# EAGLE design AutoTuner (EAGLE 9.6.2)

## Sheet 1 of 4: mcu
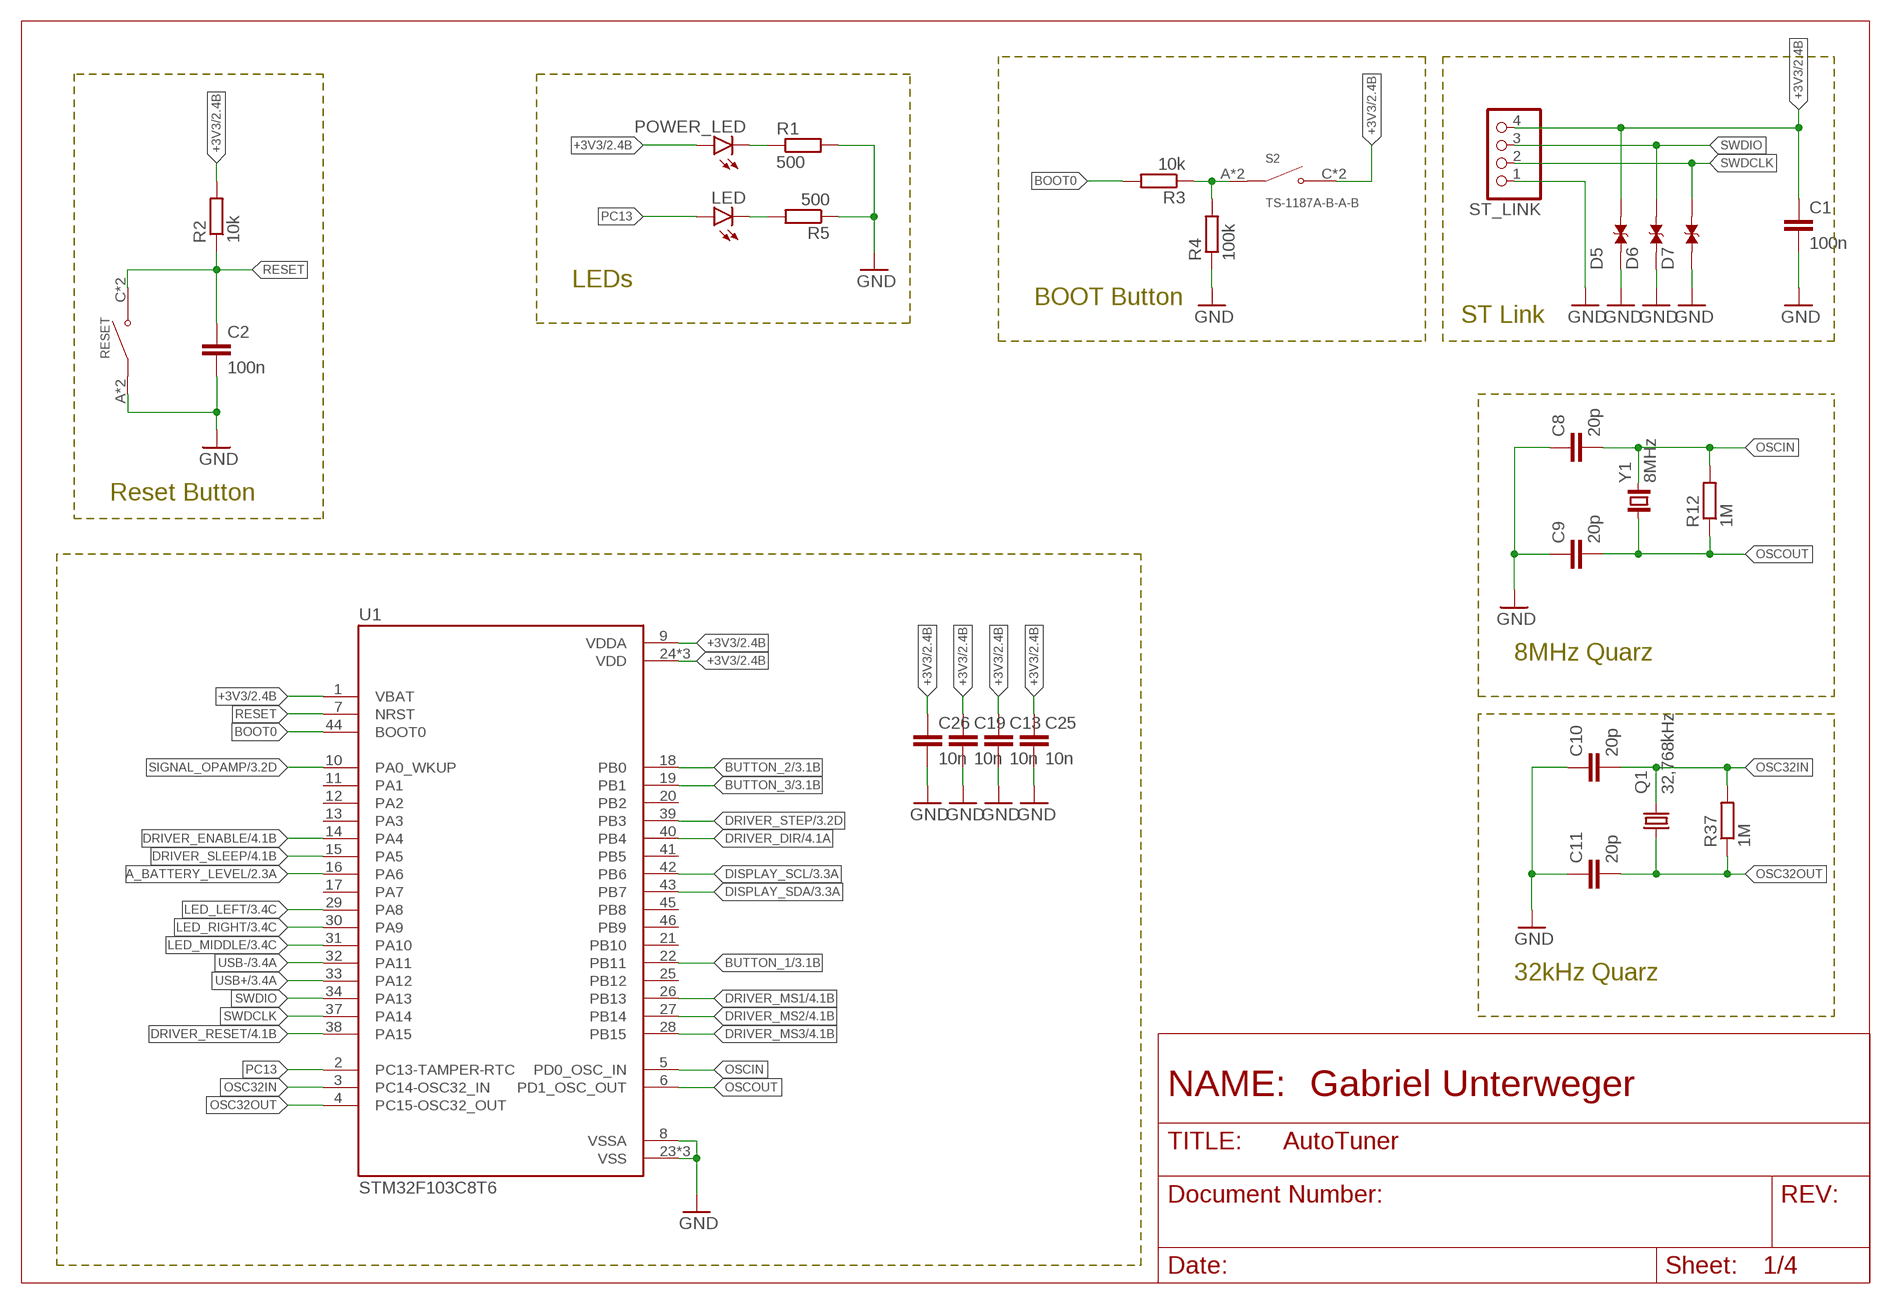
[diagram p0: schematic, sheet 1]

### Parts
C1  100n  C-EUC0805  [C0805]
C2  100n  C-EUC0805  [C0805]
C8  20p  C-EUC0805  [C0805]
C9  20p  C-EUC0805  [C0805]
C10  20p  C-EUC0805  [C0805]
C11  20p  C-EUC0805  [C0805]
C13  10n  C-EUC0805  [C0805]
C19  10n  C-EUC0805  [C0805]
C25  10n  C-EUC0805  [C0805]
C26  10n  C-EUC0805  [C0805]
D5  TESD5V0L1UC_RJG  [DIO_TESD5V0L1UC_RJG]
D6  TESD5V0L1UC_RJG  [DIO_TESD5V0L1UC_RJG]
D7  TESD5V0L1UC_RJG  [DIO_TESD5V0L1UC_RJG]
LED  LEDCHIPLED_0805  [CHIPLED_0805]
POWER_LED  LEDCHIPLED_0805  [CHIPLED_0805]
Q1  32,768kHz  KX-327-NHF  [3.2X1.5]
R1  500  R-EU_R0805  [R0805]
R2  10k  R-EU_R0805  [R0805]
R3  10k  R-EU_R0805  [R0805]
R4  100k  R-EU_R0805  [R0805]
R5  500  R-EU_R0805  [R0805]
R12  1M  R-EU_R0805  [R0805]
R37  1M  R-EU_R0805  [R0805]
RESET  TS-1187A-B-A-B  [SW_TS-1187A-B-A-B]
S2  TS-1187A-B-A-B  [SW_TS-1187A-B-A-B]
ST_LINK  PINHD-1X4  [1X04]
U1  STM32F103C8T6  [QFP50P900X900X160-48N]
Y1  8MHz  CRYSTAL_NX5032GA  [CRYSTAL_2-SMD-5X3]

### Nets
+3V3: C1.1 C13.1 C19.1 C25.1 C26.1 D5.2 POWER_LED.A R2.2 S2.C(NO) S2.D(NO) ST_LINK.4 U1.1(VBAT) U1.9(VDDA) U1.24(VDD) U1.36(VDD) U1.48(VDD) ; also sheet 2,3,4
A_BATTERY_LEVEL: U1.16(PA6) ; also sheet 2
BOOT0: R3.2 U1.44(BOOT0)
BUTTON_1: U1.22(PB11) ; also sheet 3
BUTTON_2: U1.18(PB0) ; also sheet 3
BUTTON_3: U1.19(PB1) ; also sheet 3
DISPLAY_SCL: U1.42(PB6) ; also sheet 3
DISPLAY_SDA: U1.43(PB7) ; also sheet 3
DRIVER_DIR: U1.40(PB4) ; also sheet 4
DRIVER_ENABLE: U1.14(PA4) ; also sheet 4
DRIVER_MS1: U1.26(PB13) ; also sheet 4
DRIVER_MS2: U1.27(PB14) ; also sheet 4
DRIVER_MS3: U1.28(PB15) ; also sheet 4
DRIVER_RESET: U1.38(PA15) ; also sheet 4
DRIVER_SLEEP: U1.15(PA5) ; also sheet 4
DRIVER_STEP: U1.39(PB3) ; also sheet 3,4
GND: C1.2 C2.2 C8.1 C9.1 C10.1 C11.1 C13.2 C19.2 C25.2 C26.2 D5.1 D6.1 D7.1 R1.2 R4.1 R5.1 RESET.A(COM) RESET.B(COM) ST_LINK.1 U1.8(VSSA) U1.23(VSS) U1.35(VSS) U1.47(VSS) ; also sheet 2,3,4
LED_LEFT: U1.29(PA8) ; also sheet 3
LED_MIDDLE: U1.31(PA10) ; also sheet 3
LED_RIGHT: U1.30(PA9) ; also sheet 3
N$2: LED.C R5.2
N$3: POWER_LED.C R1.1
N$5: R3.1 R4.2 S2.A(COM) S2.B(COM)
OSC32IN: C10.2 Q1.2 R37.2 U1.3(PC14-OSC32_IN)
OSC32OUT: C11.2 Q1.1 R37.1 U1.4(PC15-OSC32_OUT)
OSCIN: C8.2 R12.2 U1.5(PD0_OSC_IN) Y1.2
OSCOUT: C9.2 R12.1 U1.6(PD1_OSC_OUT) Y1.1
PC13: LED.A U1.2(PC13-TAMPER-RTC)
RESET: C2.1 R2.1 RESET.C(NO) RESET.D(NO) U1.7(NRST)
SIGNAL_OPAMP: U1.10(PA0_WKUP) ; also sheet 3,4
SWDCLK: D7.2 ST_LINK.2 U1.37(PA14)
SWDIO: D6.2 ST_LINK.3 U1.34(PA13)
USB+: U1.33(PA12) ; also sheet 3
USB-: U1.32(PA11) ; also sheet 3
Unconnected: U1.11(PA1) U1.12(PA2) U1.13(PA3) U1.17(PA7) U1.20(PB2) U1.21(PB10) U1.25(PB12) U1.41(PB5) U1.45(PB8) U1.46(PB9)

### Notes on the sheet
- LEDs
- BOOT Button
- ST Link
- Reset Button
- 8MHz Quarz
- 32kHz Quarz

## Sheet 2 of 4: battery / voltage converter
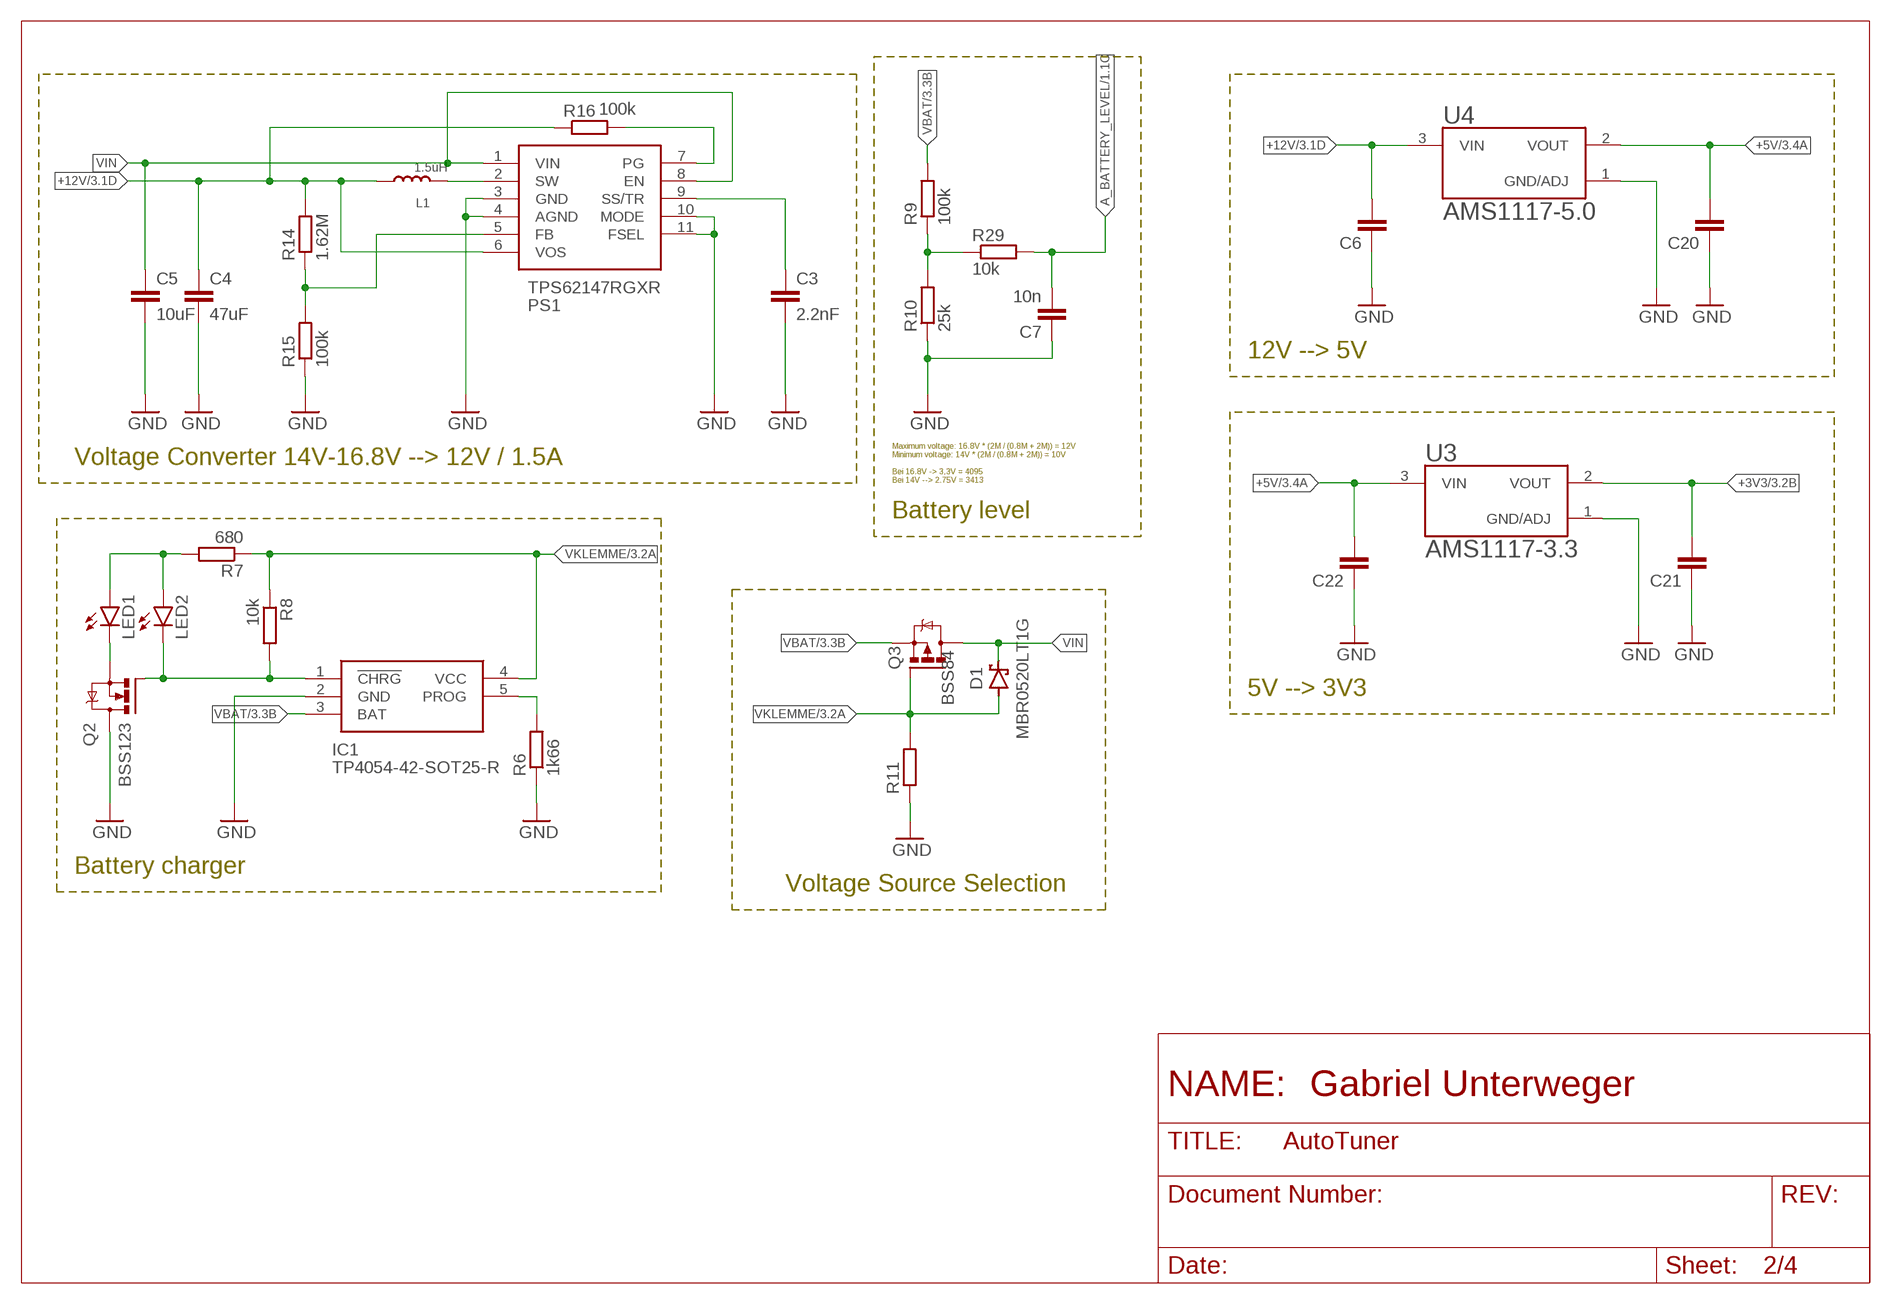
[diagram p1: schematic, sheet 2]

### Parts
C3  2.2nF  C-EUC0805  [C0805]
C4  47uF  C-EUC0805  [C0805]
C5  10uF  C-EUC0805  [C0805]
C6  C-EUC0805  [C0805]
C7  10n  C-EUC0805  [C0805]
C20  C-EUC0805  [C0805]
C21  C-EUC0805  [C0805]
C22  C-EUC0805  [C0805]
D1  MBR0520LT1G  SCHOTTKY_MBR0520LT1GDO-219  [SODFL3718X115]
IC1  TP4054-42-SOT25-R  [SOT95P280X100-5N]
L1  1.5uH  PSPCAQ54  [PSPCAQ54]
LED1  LEDCHIPLED_0805  [CHIPLED_0805]
LED2  LEDCHIPLED_0805  [CHIPLED_0805]
PS1  TPS62147RGXR  [TPS621361RGXT]
Q2  BSS123  NMOSFET_BSS123_SOT23-GSD  [SOT23]
Q3  BSS84  PMOSFET_BSS84_SOT23-GSD  [SOT23]
R6  1k66  R-EU_R0805  [R0805]
R7  680  R-EU_R0805  [R0805]
R8  10k  R-EU_R0805  [R0805]
R9  100k  R-EU_R0805  [R0805]
R10  25k  R-EU_R0805  [R0805]
R11  R-EU_R0805  [R0805]
R14  1.62M  R-EU_R0805  [R0805]
R15  100k  R-EU_R0805  [R0805]
R16  100k  R-EU_R0805  [R0805]
R29  10k  R-EU_R0805  [R0805]
U3  AMS1117-3.3  [SOT229P700X180-4N]
U4  AMS1117-5.0  [SOT229P700X180-4N]

### Nets
+3V3: C21.2 U3.2(VOUT) ; also sheet 1,3,4
+5V: C20.2 C22.2 U3.3(VIN) U4.2(VOUT) ; also sheet 3,4
+12V: C4.1 C6.2 L1.1 PS1.6(VOS) R14.2 R16.1 U4.3(VIN) ; also sheet 3,4
A_BATTERY_LEVEL: C7.2 R29.2 ; also sheet 1
GND: C3.2 C4.2 C5.2 C6.1 C7.1 C20.1 C21.1 C22.1 IC1.2(GND) PS1.3(GND) PS1.4(AGND) PS1.10(MODE) PS1.11(FSEL) Q2.3(D) R6.1 R10.1 R11.1 R15.1 U3.1(GND/ADJ) U4.1(GND/ADJ) ; also sheet 1,3,4
N$1: C3.1 PS1.9(SS/TR)
N$4: R9.1 R10.2 R29.1
N$6: L1.2 PS1.2(SW)
N$7: PS1.5(FB) R14.1 R15.2
N$8: IC1.5(PROG) R6.2
N$9: IC1.1(!CHRG) LED2.C Q2.1(G) R8.2
N$10: PS1.7(PG) R16.2
N$11: LED1.A LED2.A R7.2
N$12: LED1.C Q2.2(S)
VBAT: IC1.3(BAT) Q3.2(S) R9.2 ; also sheet 3
VIN: C5.1 D1.1(C) PS1.1(VIN) PS1.8(EN) Q3.3(D)
VKLEMME: D1.2(A) IC1.4(VCC) Q3.1(G) R7.1 R8.1 R11.2 ; also sheet 3

### Notes on the sheet
- 12V --> 5V
- Voltage Converter 14V-16.8V --> 12V / 1.5A
- Maximum voltage: 16.8V * (2M / (0.8M + 2M)) = 12V
  Minimum voltage: 14V * (2M / (0.8M + 2M)) = 10V
  
  Bei 16.8V -> 3,3V = 4095
  Bei 14V --> 2.75V = 3413
- Battery level
- 5V --> 3V3
- Battery charger
- Voltage Source Selection

## Sheet 3 of 4: I/O
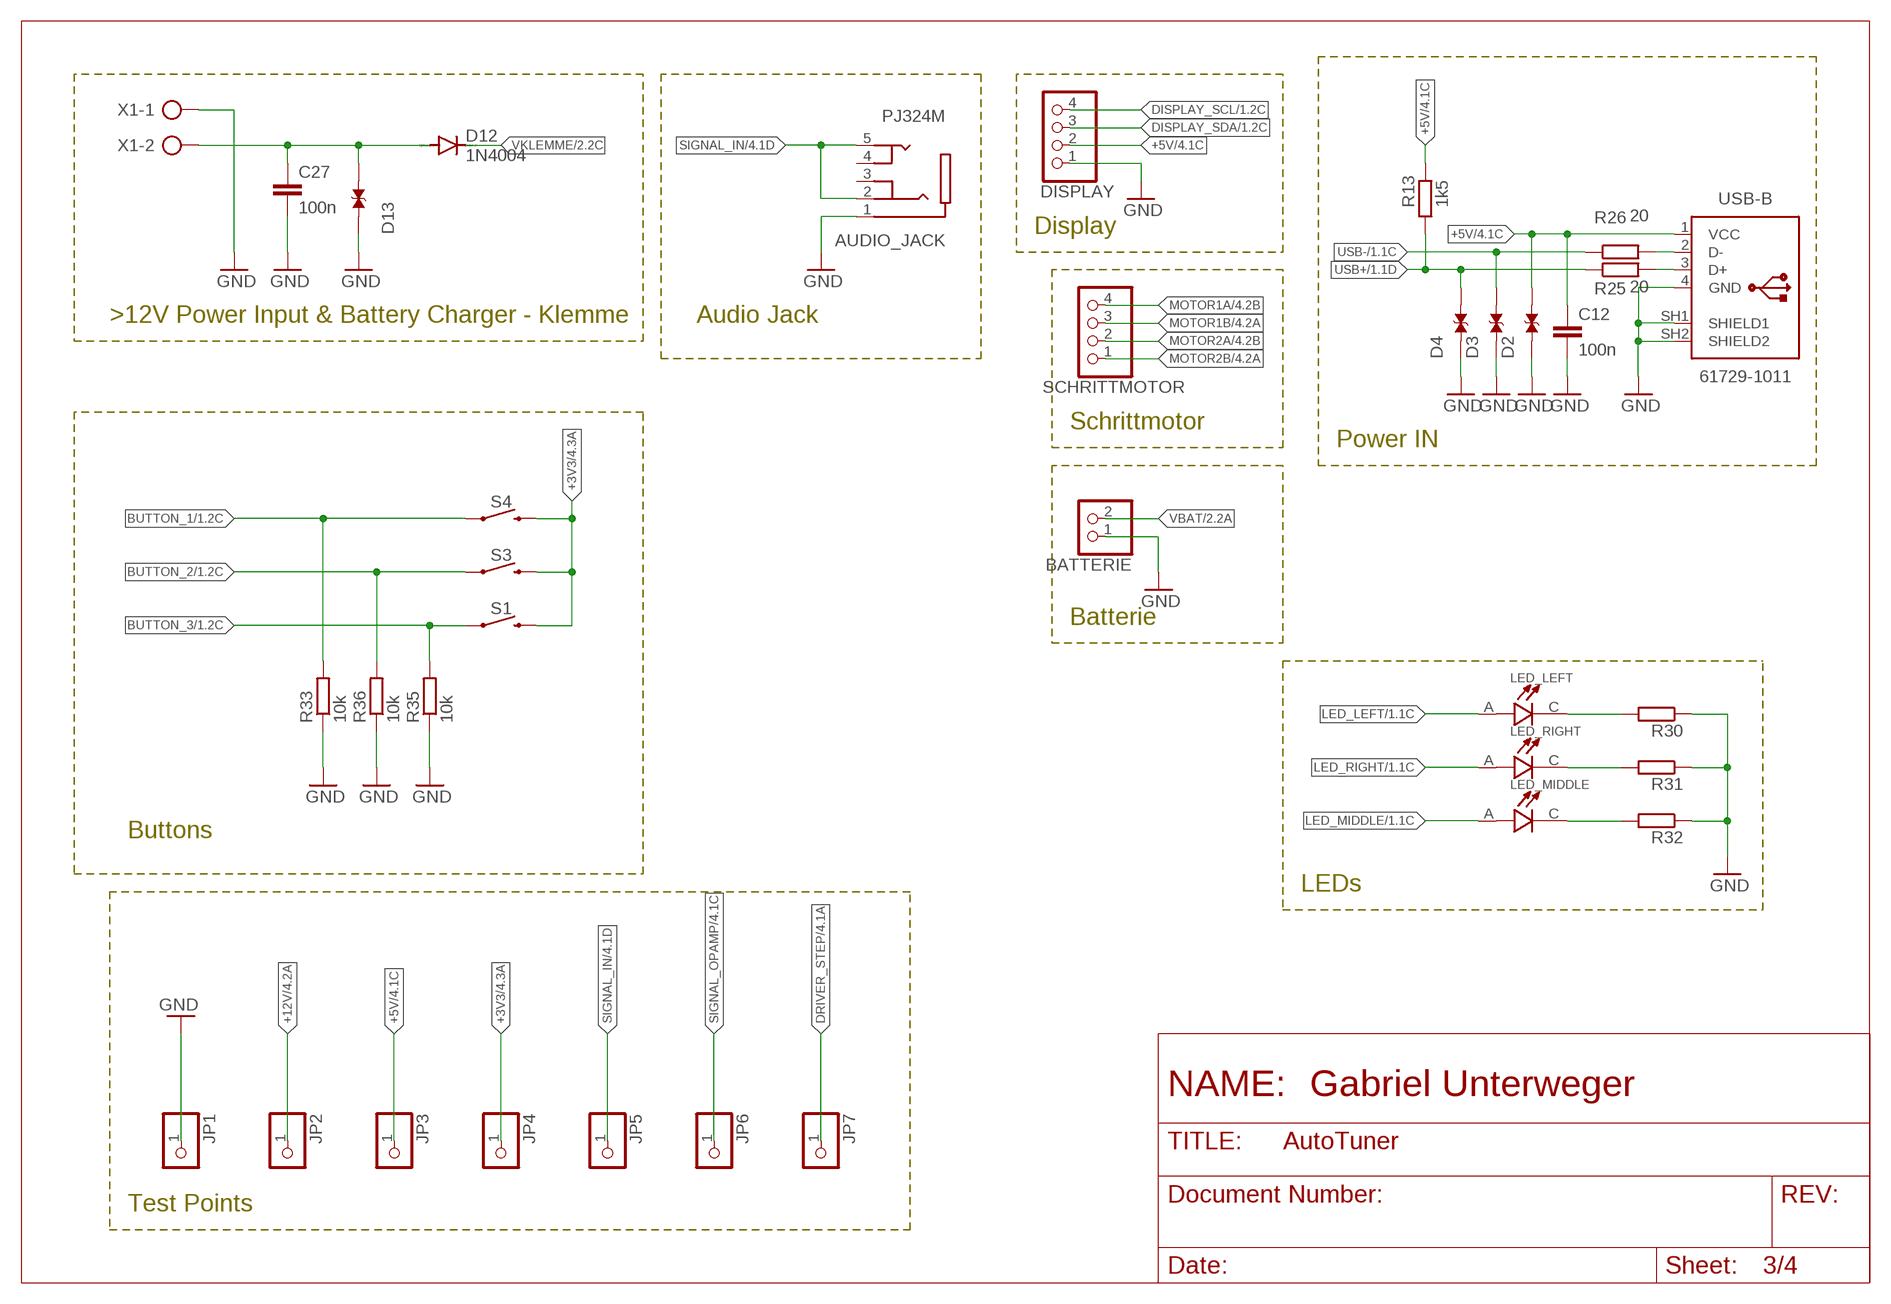
[diagram p2: schematic, sheet 3]

### Parts
AUDIO_JACK  PJ324M  [WENZHOU_PJ324M]
BATTERIE  PINHD-1X2  [1X02]
C12  100n  C-EUC0805  [C0805]
C27  100n  C-EUC0805  [C0805]
D2  TESD5V0L1UC_RJG  [DIO_TESD5V0L1UC_RJG]
D3  TESD5V0L1UC_RJG  [DIO_TESD5V0L1UC_RJG]
D4  TESD5V0L1UC_RJG  [DIO_TESD5V0L1UC_RJG]
D12  1N4004  [DO41-10]
D13  TESD5V0L1UC_RJG  [DIO_TESD5V0L1UC_RJG]
DISPLAY  PINHD-1X4  [1X04]
JP1  PINHD-1X1  [1X01]
JP2  PINHD-1X1  [1X01]
JP3  PINHD-1X1  [1X01]
JP4  PINHD-1X1  [1X01]
JP5  PINHD-1X1  [1X01]
JP6  PINHD-1X1  [1X01]
JP7  PINHD-1X1  [1X01]
LED_LEFT  L-53GD  [LEDRD254W50D500H1060]
LED_MIDDLE  L-53GD  [LEDRD254W50D500H1060]
LED_RIGHT  L-53GD  [LEDRD254W50D500H1060]
R13  1k5  R-EU_R0805  [R0805]
R25  20  R-EU_R0805  [R0805]
R26  20  R-EU_R0805  [R0805]
R30  R-EU_R0805  [R0805]
R31  R-EU_R0805  [R0805]
R32  R-EU_R0805  [R0805]
R33  10k  R-EU_R0805  [R0805]
R35  10k  R-EU_R0805  [R0805]
R36  10k  R-EU_R0805  [R0805]
S1  MOMENTARY-SWITCH-SPST-PTH-12MM  [TACTILE_SWITCH_PTH_12MM]
S3  MOMENTARY-SWITCH-SPST-PTH-12MM  [TACTILE_SWITCH_PTH_12MM]
S4  MOMENTARY-SWITCH-SPST-PTH-12MM  [TACTILE_SWITCH_PTH_12MM]
SCHRITTMOTOR  PINHD-1X4  [1X04]
USB-B  61729-1011  [61729-1011BLF]
X1  AK300/2  [AK300/2]

### Nets
+3V3: JP4.1 S1.3 S3.3 S4.3 ; also sheet 1,2,4
+5V: C12.1 D2.2 DISPLAY.2 JP3.1 R13.2 USB-B.1(VCC) ; also sheet 2,4
+12V: JP2.1 ; also sheet 2,4
BUTTON_1: R33.2 S4.1 ; also sheet 1
BUTTON_2: R36.2 S3.1 ; also sheet 1
BUTTON_3: R35.2 S1.1 ; also sheet 1
DISPLAY_SCL: DISPLAY.4 ; also sheet 1
DISPLAY_SDA: DISPLAY.3 ; also sheet 1
DRIVER_STEP: JP7.1 ; also sheet 1,4
GND: AUDIO_JACK.1(SLEEVE) BATTERIE.1 C12.2 C27.2 D2.1 D3.1 D4.1 D13.1 DISPLAY.1 JP1.1 R30.1 R31.1 R32.1 R33.1 R35.1 R36.1 USB-B.4(GND) USB-B.SH1(SHIELD1) USB-B.SH2(SHIELD2) X1.1 ; also sheet 1,2,4
LED_LEFT: LED_LEFT.A ; also sheet 1
LED_MIDDLE: LED_MIDDLE.A ; also sheet 1
LED_RIGHT: LED_RIGHT.A ; also sheet 1
MOTOR1A: SCHRITTMOTOR.4 ; also sheet 4
MOTOR1B: SCHRITTMOTOR.3 ; also sheet 4
MOTOR2A: SCHRITTMOTOR.2 ; also sheet 4
MOTOR2B: SCHRITTMOTOR.1 ; also sheet 4
N$15: C27.1 D12.A D13.2 X1.2
N$19: LED_LEFT.C R30.2
N$20: LED_RIGHT.C R31.2
N$23: LED_MIDDLE.C R32.2
N$29: R25.2 USB-B.3(D+)
N$30: R26.2 USB-B.2(D-)
SIGNAL_IN: AUDIO_JACK.2(RING_1) AUDIO_JACK.5(TIP_2) JP5.1 ; also sheet 4
SIGNAL_OPAMP: JP6.1 ; also sheet 1,4
USB+: D4.2 R13.1 R25.1 ; also sheet 1
USB-: D3.2 R26.1 ; also sheet 1
VBAT: BATTERIE.2 ; also sheet 2
VKLEMME: D12.C ; also sheet 2
Unconnected: AUDIO_JACK.3(RING_2) AUDIO_JACK.4(TIP_1)

### Notes on the sheet
- Display
- >12V Power Input & Battery Charger - Klemme | Audio Jack
- Schrittmotor
- Power IN
- Batterie
- Buttons
- LEDs
- Test Points

## Sheet 4 of 4: Motor Steuerung / Signal Verarbeitung
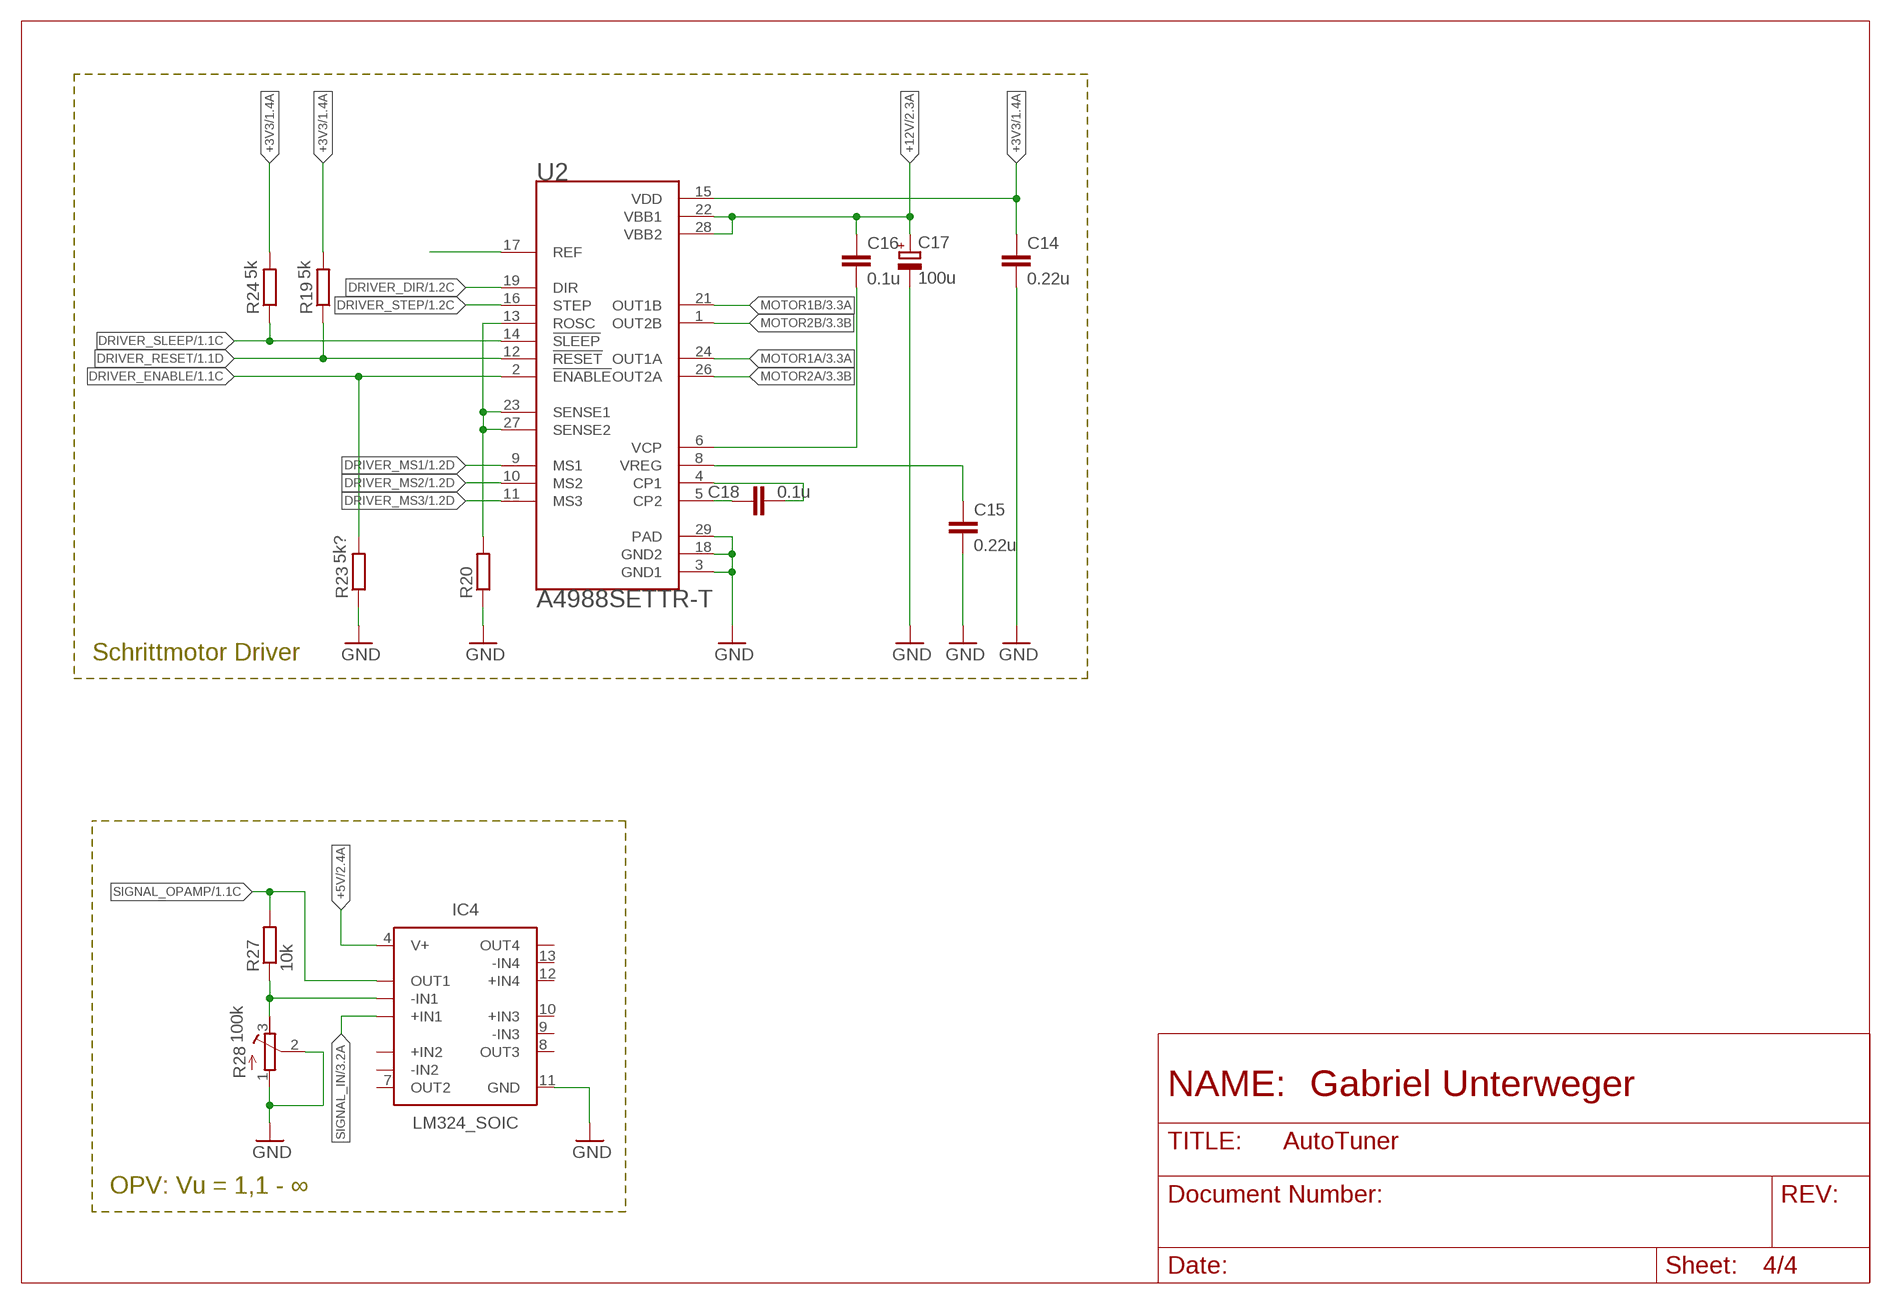
[diagram p3: schematic, sheet 4]

### Parts
C14  0.22u  C-EUC0805  [C0805]
C15  0.22u  C-EUC0805  [C0805]
C16  0.1u  C-EUC0805  [C0805]
C17  100u  CPOL-EU085CS-1AR  [085CS_1AR]
C18  0.1u  C-EUC0805  [C0805]
IC4  LM324_SOIC  [SOIC127P600X175-14N]
R19  5k  R-EU_R0805  [R0805]
R20  R-EU_R0805  [R0805]
R23  5k?  R-EU_R0805  [R0805]
R24  5k  R-EU_R0805  [R0805]
R27  10k  R-EU_R0805  [R0805]
R28  100k  R-TRIMM3296X  [RTRIM3296X]
U2  A4988SETTR-T  [QFN50P500X500X90-29N]

### Nets
+3V3: C14.1 R19.2 R24.2 U2.15(VDD) ; also sheet 1,2,3
+5V: IC4.4(V+) ; also sheet 2,3
+12V: C16.1 C17.+ U2.22(VBB1) U2.28(VBB2) ; also sheet 2,3
DRIVER_DIR: U2.19(DIR) ; also sheet 1
DRIVER_ENABLE: R23.2 U2.2(!ENABLE) ; also sheet 1
DRIVER_MS1: U2.9(MS1) ; also sheet 1
DRIVER_MS2: U2.10(MS2) ; also sheet 1
DRIVER_MS3: U2.11(MS3) ; also sheet 1
DRIVER_RESET: R19.1 U2.12(!RESET) ; also sheet 1
DRIVER_SLEEP: R24.1 U2.14(!SLEEP) ; also sheet 1
DRIVER_STEP: U2.16(STEP) ; also sheet 1,3
GND: C14.2 C15.2 C17.- IC4.11(GND) R20.1 R23.1 R28.1(A) R28.2(S) U2.3(GND1) U2.18(GND2) U2.29(PAD) ; also sheet 1,2,3
MOTOR1A: U2.24(OUT1A) ; also sheet 3
MOTOR1B: U2.21(OUT1B) ; also sheet 3
MOTOR2A: U2.26(OUT2A) ; also sheet 3
MOTOR2B: U2.1(OUT2B) ; also sheet 3
N$16: IC4.2(-IN1) R27.1 R28.3(E)
N$26: R20.2 U2.13(ROSC) U2.23(SENSE1) U2.27(SENSE2)
N$27: C16.2 U2.6(VCP)
N$54: U2.17(REF)
N$62: C15.1 U2.8(VREG)
N$63: C18.2 U2.4(CP1)
N$64: C18.1 U2.5(CP2)
SIGNAL_IN: IC4.3(+IN1) ; also sheet 3
SIGNAL_OPAMP: IC4.1(OUT1) R27.2 ; also sheet 1,3
Unconnected: IC4.5(+IN2) IC4.6(-IN2) IC4.7(OUT2) IC4.8(OUT3) IC4.9(-IN3) IC4.10(+IN3) IC4.12(+IN4) IC4.13(-IN4) IC4.14(OUT4)

### Notes on the sheet
- Schrittmotor Driver
- OPV: Vu = 1,1 - ∞

## Library data of the parts
AUDIO_JACK = PJ324M:PJ324M: Headphone Stereo jack/Audio connector Check availability <https://pricing.snapeda.com/parts/PJ324M/Wenzhou%20QingPu%20Electronics%20Co.Ltd/view-part?ref=eda>; AVAILABILITY: Not in stock; CHECK_PRICES: https://www.snapeda.com/parts/PJ324M/Wenzhou+QingPu+Electronics+Co.Ltd/view-part/?ref=eda; DESCRIPTION: Headphone Stereo jack/Audio connector; MF: Wenzhou QingPu Electronics Co.Ltd; MP: PJ324M; PACKAGE: Package; PRICE: None; SNAPEDA_LINK: https://www.snapeda.com/parts/PJ324M/Wenzhou+QingPu+Electronics+Co.Ltd/view-part/?ref=snap
BATTERIE = pinhead:PINHD-1X2: PIN HEADER
C1-C16 C18-C22 C25-C27 = rcl:C-EU: CAPACITOR, European symbol; SPICEPREFIX: C
C17 = rcl:CPOL-EU: POLARIZED CAPACITOR, European symbol; SPICEPREFIX: C
D1 = Diode:SCHOTTKY_: Schottky Diode - Popular parts; CATEGORY: Diode; DESCRIPTION: DIODE SCHOTTKY 20V 500MA SOD123; LCSC_PART: C191023; MANUFACTURER: ON Semiconductor; MPN: MBR0520LT1G; SUB-CATEGORY: Schottky
D2-D6 D13 = TESD5V0L1UC_RJG:TESD5V0L1UC_RJG: Check availability <https://pricing.snapeda.com/parts/TESD5V0L1UC%20RJG/Taiwan%20Semiconductor%20Corporation/view-part?ref=eda>; AVAILABILITY: In Stock; CHECK_PRICES: https://www.snapeda.com/parts/TESD5V0L1UC%20RJG/Taiwan+Semiconductor/view-part/?ref=eda; DESCRIPTION: DFN1006L, 5V, 100W, 2pF, ESD Protection Diode & Array; MF: Taiwan Semiconductor Corporation; MP: TESD5V0L1UC RJG; PACKAGE: DFN1006L Taiwan Semiconductor; PRICE: None; PURCHASE-URL: https://www.snapeda.com/api/url_track_click_mouser/?unipart_id=3789592&manufacturer=Taiwan Semiconductor Corporation&part_name=TESD5V0L1UC RJG&search_term=protection diode; SNAPEDA_LINK: https://www.snapeda.com/parts/TESD5V0L1UC%20RJG/Taiwan+Semiconductor/view-part/?ref=snap
D7 = TESD5V0L1UC_RJG:TESD5V0L1UC_RJG: Check availability <https://pricing.snapeda.com/parts/TESD5V0L1UC%20RJG/Taiwan%20Semiconductor%20Corporation/view-part?ref=eda>; AVAILABILITY: In Stock; CHECK_PRICES: https://www.snapeda.com/parts/TESD5V0L1UC%20RJG/Taiwan+Semiconductor/view-part/?ref=eda; DESCRIPTION: DFN1006L, 5V, 100W, 2pF, ESD Protection Diode & Array; LCSC_PART: C7420372; MF: Taiwan Semiconductor Corporation; MP: TESD5V0L1UC RJG; PACKAGE: DFN1006L Taiwan Semiconductor; PRICE: None; PURCHASE-URL: https://www.snapeda.com/api/url_track_click_mouser/?unipart_id=3789592&manufacturer=Taiwan Semiconductor Corporation&part_name=TESD5V0L1UC RJG&search_term=protection diode; SNAPEDA_LINK: https://www.snapeda.com/parts/TESD5V0L1UC%20RJG/Taiwan+Semiconductor/view-part/?ref=snap
D12 = diode:1N4004: DIODE general purpose rectifier, 1 A
DISPLAY SCHRITTMOTOR ST_LINK = pinhead:PINHD-1X4: PIN HEADER
IC1 = TP4054-42-SOT25-R:TP4054-42-SOT25-R: Standalone Linear Li-ion Battery Charger with Thermal Regulation, SOT-23-5 Source: Datasheet <http://images.100y.com.tw/pdf_file/38-TP-TP4054x.pdf>; DESCRIPTION: Standalone Linear Li-ion Battery Charger with Thermal Regulation, SOT-23-5; HEIGHT: 1mm; LCSC_PART: C32574; MANUFACTURER_NAME: TOP POWER; MANUFACTURER_PART_NUMBER: TP4054-42-SOT25-R
IC4 = IC_Linear:LM324: Quad-Operational Amplifiers Reference Datasheet <https://www.ti.com/lit/ds/snosc16d/snosc16d.pdf>; CATEGORY: Operational Amplifiers; DESCRIPTION: Quad-Operational Amplifiers; LCSC_PART: C71035; MANUFACTURER: Generic; MPN: Generic; SERIES: LM324; SUB-CATEGORY: Amplifier ICs; TYPE: Op Amps - Operational Amplifiers
JP1-JP7 = pinhead:PINHD-1X1: PIN HEADER
L1 = PSPCAQ54:PSPCAQ54; LCSC_PART: C2686105
LED LED1 LED2 POWER_LED = led:LED: LED OSRAM: - CHIPLED LG R971, LG N971, LY N971, LG Q971, LY Q971, LO R971, LY R971 LH N974, LH R974 LS Q976, LO Q976, LY Q976 LO Q996 - Hyper CHIPLED LW Q18S LB Q993, LB Q99A, LB R99A - SideLED LS A670, LO A670, LY A670, LG A670, LP A670 LB A673, LV A673, LT A673, LW A673 LH A674 LY A675 LS A676, LA A676, LO A676, LY A676, LW A676 LS A679, LY A679, LG A679 - Hyper Micro SIDELED® LS Y876, LA Y876, LO Y876, LY Y876 LT Y87S - SmartLED LW L88C, LW L88S LB L89C, LB L89S, LG L890 LS L89K, LO L89K, LY L89K LS L896, LA L896, LO L896, LY L896 - TOPLED LS T670, LO T670, LY T670, LG T670, LP T670 LSG T670, LSP T670, LSY T670, LOP T670, LYG T670 LG T671, LOG T671, LSG T671 LB T673, LV T673, LT T673, LW T673 LH T674 LS T676, LA T676, LO T676, LY T676, LB T676, LH T676, LSB T676, LW T676 LB T67C, LV T67C, LT T67C, LS T67K, LO T67K, LY T67K, LW E67C LS E67B, LA E67B, LO E67B, LY E67B, LB E67C, LV E67C, LT E67C LW T67C LS T679, LY T679, LG T679 LS T770, LO T770, LY T770, LG T770, LP T770 LB T773, LV T773, LT T773, LW T773 LH T774 LS E675, LA E675, LY E675, LS T675 LS T776, LA T776, LO T776, LY T776, LB T776 LHGB T686 LT T68C, LB T68C - Hyper Mini TOPLED® LB M676 - Mini TOPLED Santana® LG M470 LS M47K, LO M47K, LY M47K Source: http://www.osram.convergy.de LUXEON: - LUMILED® LXK2-PW12-R00, LXK2-PW12-S00, LXK2-PW14-U00, LXK2-PW14-V00 LXK2-PM12-R00, LXK2-PM12-S00, LXK2-PM14-U00 LXK2-PE12-Q00, LXK2-PE12-R00, LXK2-PE12-S00, LXK2-PE14-T00, LXK2-PE14-U00 LXK2-PB12-K00, LXK2-PB12-L00, LXK2-PB12-M00, LXK2-PB14-N00, LXK2-PB14-P00, LXK2-PB14-Q00 LXK2-PR12-L00, LXK2-PR12-M00, LXK2-PR14-Q00, LXK2-PR14-R00 LXK2-PD12-Q00, LXK2-PD12-R00, LXK2-PD12-S00 LXK2-PH12-R00, LXK2-PH12-S00 LXK2-PL12-P00, LXK2-PL12-Q00, LXK2-PL12-R00 Source: www.luxeon.com KINGBRIGHT: KA-3528ASYC Source: www.kingbright.com
LED_LEFT LED_MIDDLE LED_RIGHT = L-53GD:L-53GD: LED; 5mm; green; 5-32mcd; 60°; Front: convex Check availability <https://pricing.snapeda.com/parts/L-53GD/Kingbright/view-part?ref=eda>; AVAILABILITY: In Stock; CHECK_PRICES: https://www.snapeda.com/parts/L-53GD/Kingbright/view-part/?ref=eda; DESCRIPTION: LED; 5mm; green; 5-32mcd; 60°; Front: convex; MF: Kingbright; MP: L-53GD; PACKAGE: CDIP-28 Kingbright; PRICE: None; PURCHASE-URL: https://www.snapeda.com/api/url_track_click_mouser/?unipart_id=525636&manufacturer=Kingbright&part_name=L-53GD&search_term=led, 5mm; SNAPEDA_LINK: https://www.snapeda.com/parts/L-53GD/Kingbright/view-part/?ref=snap
PS1 = TPS62147RGXR:TPS62147RGXR: 3-17V 2.0A Step-Down Converter with 1% accuracy and PFM/Forced-PWM in 2x3QFN Source: Datasheet <http://www.ti.com/lit/gpn/tps62147>; ARROW_PART_NUMBER: TPS62147RGXR; ARROW_PRICE-STOCK: https://www.arrow.com/en/products/tps62147rgxr/texas-instruments?region=nac; DESCRIPTION: 3-17V 2.0A Step-Down Converter with 1% accuracy and PFM/Forced-PWM in 2x3QFN; HEIGHT: 1mm; MANUFACTURER_NAME: Texas Instruments; MANUFACTURER_PART_NUMBER: TPS62147RGXR; MOUSER_PART_NUMBER: 595-TPS62147RGXR; MOUSER_PRICE-STOCK: https://www.mouser.co.uk/ProductDetail/Texas-Instruments/TPS62147RGXR?qs=55YtniHzbhCZLqc4f%2F%2FuZw%3D%3D
Q1 = crystal-geyer_V1_0:KX-327: Tuning Fork Crystals (kHz) SMD: KX327 - Serie Model Size l/w/h [mm] Frequency Range Frequency Stability Temp. Range [°C] Load Capacitance AECQ 200 availabel Datasheet KX-327VT KX-327FT KX-327RT KX-327NHT KX-327NHF KX-327L KX-327S 1.25/1.05/0.5 1.6/1.0/0.5 2.0/1.2/0.6 3.2/1.5/0.8 3.2/1.5/0.8 7.0/1.5/1.4 8.2/3.8/2.5 32,768 kHz 32,768 kHz 32,768 kHz 32,768 kHz 32,768 kHz 32,768 kHz 32,768 kHz ±10 … ±20ppm ±10 … ±20ppm ±10 … ±20ppm ±10 … ±20ppm ±10 … ±20ppm ±10 … ±20ppm ±5 … ±20ppm (*) -40°C …+85°C (*) -40°C …+85°C (*) -40°C …+85°C (*) -40°C …+85°C (*) -40°C …+125°C (*) -40°C …+85°C (*) -40°C …+85°C 7/9/12,5 7/9/12,5 7/9/12,6 7/9/12,5 9/12,5 7/9/12,5 6/12,5 - - - - yes - - KX-327VT.pdf <http://www.geyer-electronic.de/uploads/tx_userartikelfrequenz/GEYER-KX-327VT.pdf> KX-327FT.pdf <http://www.geyer-electronic.de/uploads/tx_userartikelfrequenz/GEYER-KX-327FT.pdf> KX-327RT.pdf <http://www.geyer-electronic.de/uploads/tx_userartikelfrequenz/GEYER-KX-327RT.pdf> KX-327NHT.pdf <http://www.geyer-electronic.de/uploads/tx_userartikelfrequenz/GEYER-KX-327NHT.pdf> KX-327NHF.pdf <http://www.geyer-electronic.de/uploads/tx_userartikelfrequenz/GEYER-KX-327NHF.pdf> KX-327L.pdf <http://www.geyer-electronic.de/uploads/tx_userartikelfrequenz/GEYER-KX-327L.pdf> KX-327S.pdf <http://www.geyer-electronic.de/uploads/tx_userartikelfrequenz/GEYER-KX-327S.pdf> <http://www.geyer-electronic.de/fileadmin/template/img/logo-geyer-electronic.png> Details see: http://www.geyer-electronic.de/Frequenz-Produkte.9.0.html Created 2016-06-07, Hans Locher 2016 (C) Geyer Quartz Technology KX327VT,KX327FT,KX327RT,KX327NHT,KX327NHF,KX327S,KX327L;125105;1610;2012;3215;7015;8238;1,25x1,05,1.25x1.05;1,6x1,0,1.6x1.0;2,0x1,2,2.0x1.2;3,2x1,5,3.2x1.5;8,2x3,8,8.2x3.8,7.0x1.5,7,0x1,532.768kHz; LCSC_PART: C32346
Q2 = Transistor:NMOSFET_: N-Channel MOSFET - Popular parts; CATEGORY: Transistor; DESCRIPTION: MOSFET N-CH 100V 0.17A SOT-23; DRAIN_CURRENT: 170mA; LCSC_PART: C20917; MANUFACTURER: ON Semiconductor; MPN: BSS123L; OPERATING_TEMP: -55°C ~ 150°C; PART_STATUS: Active; ROHS_COMPLIANT: Yes; SUB-CATEGORY: MOSFET; THERMALLOSS: 360mW; TYPE: N-Channel
Q3 = Transistor:PMOSFET_: P-Channel MOSFET - Popular parts; CATEGORY: Transistor; DESCRIPTION: MOSFET P-CH 50V 130MA SOT-23; DRAIN_CURRENT: 130mA; MANUFACTURER: ON Semiconductor; MPN: BSS84; OPERATING_TEMP: -55°C ~ 150°C; PART_STATUS: Active; ROHS_COMPLIANT: Yes; SUB-CATEGORY: MOSFET; THERMALLOSS: 360mW; TYPE: P-Channel
R1-R16 R19 R20 R23-R27 R29-R33 R35-R37 = rcl:R-EU_: RESISTOR, European symbol; SPICEPREFIX: R
R28 = rcl:R-TRIMM: Trimm resistor; SPICEMODEL: X; SPICEPREFIXL: POT
RESET S2 = TS-1187A-B-A-B:TS-1187A-B-A-B: SPST 50mA @ 12VDC Top Actuated Round Button 160gf SMD Tactile Switches RoHS Check availability <https://pricing.snapeda.com/parts/TS-1187A-B-A-B/XKB%20Industrial%20Precision/view-part?ref=eda>; AVAILABILITY: Not in stock; DESCRIPTION: TS-1187A-B-A-B XKB Connectivity; LCSC_PART: C318884; MF: XKB Industrial Precision; MP: TS-1187A-B-A-B; PACKAGE: Package; PRICE: None
S1 S3 S4 = SparkFun-Switches:MOMENTARY-SWITCH-SPST: Momentary Switch (Pushbutton) - SPST Normally-open (NO) SPST momentary switches (buttons, pushbuttons). Variants PTH-12MM - 12mm square, through-hole Momentary Pushbutton Switch - 12mm Square <https://www.sparkfun.com/products/9190> (COM-09190) PTH-6.0MM, PTH-6.0MM-KIT - 6.0mm square, through-hole Mini Pushbutton Switch <https://www.sparkfun.com/products/97> (COM-00097) KIT package intended for soldering kit's - only one side of pads' copper is exposed. PTH-RIGHT-ANGLE-KIT - Right-angle, through-hole Right Angle Tactile Button <https://www.sparkfun.com/products/10791> - Used on SparkFun BigTime Watch Kit <https://www.sparkfun.com/products/11734> SMD-12MM - 12mm square, surface-mount Tactile Button - SMD (12mm) <https://www.sparkfun.com/products/12993> (COM-12993) Used on SparkFun PicoBoard <https://www.sparkfun.com/products/11888> SMD-4.5MM - 4.5mm Square Trackball Switch Used on SparkFun Blackberry Trackballer Breakout <https://www.sparkfun.com/products/13169> SMD-4.6MMX2.8MM - 4.60mm x 2.80mm, surface mount Used on SparkFun Pro Micro - RP2040 <https://www.sparkfun.com/products/17717> SMD-5.2MM, SMD-5.2-REDUNDANT - 5.2mm square, surface-mount Mini Pushbutton Switch - SMD <https://www.sparkfun.com/products/8720> (COM-08720) Used on Arduino Pro Mini <https://www.sparkfun.com/products/11114> REDUNDANT package connects both switch circuits together SMD-6.0X3.5MM - 6.0 x 3.5mm, surface mount Momentary Reset Switch SMD <https://www.sparkfun.com/products/8229> (COM-08229) SMD-6.2MM-TALL - 6.2mm square, surface mount Tactile Button - SMD (6mm) <https://www.sparkfun.com/products/12992> Used on SparkFun Digital Sandbox <https://www.sparkfun.com/products/12651> SMD-RIGHT-ANGLE - Right-angle, surface mount Used on SparkFun Block for Intel® Edison - Arduino <https://www.sparkfun.com/products/13036>; PROD_ID: SWCH-09185; SF_SKU: COM-09190
U1 = STM32F103C8T6:STM32F103C8T6: Mainstream Performance line, ARM Cortex-M3 MCU with 64 Kbytes Flash, 72 MHz CPU, motor control, USB and CAN Check availability <https://pricing.snapeda.com/parts/STM32F103C8T6/STMicroelectronics/view-part?ref=eda>; AVAILABILITY: In Stock; CHECK_PRICES: https://www.snapeda.com/parts/STM32F103C8T6/STMicroelectronics/view-part/?ref=eda; DESCRIPTION: ARM® Cortex®-M3 STM32F1 Microcontroller IC 32-Bit 72MHz 64KB (64K x 8) FLASH 48-LQFP (7x7); LCSC_PART: C8734; MF: STMicroelectronics; MP: STM32F103C8T6; PACKAGE: LQFP-48 STMicroelectronics; PRICE: None; PURCHASE-URL: https://www.snapeda.com/api/url_track_click_mouser/?unipart_id=52195&manufacturer=STMicroelectronics&part_name=STM32F103C8T6&search_term=stm32f103c8t6; SNAPEDA_LINK: https://www.snapeda.com/parts/STM32F103C8T6/STMicroelectronics/view-part/?ref=snap
U2 = A4988SETTR-T:A4988SETTR-T: DMOS Microstepping Driver with Translator and Overcurrent Protection Check availability <https://pricing.snapeda.com/parts/A4988SETTR-T/Allegro/view-part?ref=eda>; AVAILABILITY: In Stock; CHECK_PRICES: https://www.snapeda.com/parts/A4988SETTR-T/Allegro+Industries/view-part/?ref=eda; DESCRIPTION: Bipolar Motor Driver DMOS Logic 28-QFN (5x5); MF: Allegro; MP: A4988SETTR-T; PACKAGE: QFN-28 Allegro MicroSystems LLC; PRICE: None; PURCHASE-URL: https://www.snapeda.com/api/url_track_click_mouser/?unipart_id=46276&manufacturer=Allegro&part_name=A4988SETTR-T&search_term=a4988settr-t; SNAPEDA_LINK: https://www.snapeda.com/parts/A4988SETTR-T/Allegro+Industries/view-part/?ref=snap
U3 = AMS1117-3.3:AMS1117-3.3: Check availability <https://pricing.snapeda.com/parts/AMS1117-3.3/Advanced%20Monolithic%20Systems/view-part?ref=eda>; AVAILABILITY: Not in stock; CHECK_PRICES: https://www.snapeda.com/parts/AMS1117-3.3/Advanced+Monolithic+Systems/view-part/?ref=eda; DESCRIPTION: Sot223/Pkg 1-Amp 3.3-Volt Low Drop Out Voltage Regulatator; LCSC_PART: C6186; MF: Advanced Monolithic Systems; MP: AMS1117-3.3; PACKAGE: SOT-223 Seeed Technology; PRICE: None; SNAPEDA_LINK: https://www.snapeda.com/parts/AMS1117-3.3/Advanced+Monolithic+Systems/view-part/?ref=snap
U4 = AMS1117-5.0:AMS1117-5.0: Check availability <https://pricing.snapeda.com/parts/AMS1117-5.0/Advanced%20Monolithic%20Systems/view-part?ref=eda>; AVAILABILITY: Not in stock; CHECK_PRICES: https://www.snapeda.com/parts/AMS1117-5.0/Advanced+Monolithic+Systems/view-part/?ref=eda; DESCRIPTION: Sot223/Pkg 1-Amp 5-Volt Low Drop Out Voltage Regulatator; LCSC_PART: C6187; MF: Advanced Monolithic Systems; MP: AMS1117-5.0; PACKAGE: SOT-223 Seeed Technology; PRICE: None; SNAPEDA_LINK: https://www.snapeda.com/parts/AMS1117-5.0/Advanced+Monolithic+Systems/view-part/?ref=snap
USB-B = Connector_USB:61729-1011: USB(2.0) Type-B, RCPT, 4POS, THT-R/A Datasheet <https://www.amphenol-icc.com/media/wysiwyg/files/drawing/61729.pdf>; CATEGORY: Connector; CONTACTS: 4; CURRENT_RATING: 1A; DESCRIPTION: CONN RCPT USB2.0 TYPEB 4POS R/A; GENDER: Receptacle; MANUFACTURER: Amphenol ICC (FCI); MOUNT_TYPE: R/A; MPN: 61729-1011BLF; OPERATING_TEMP: -55°C to 85°C; PART_STATUS: Active; ROHS_COMPLIANT: RoHS Compliant; SERIES: 61729; SUB-CATEGORY: USB; TYPE: USB-B
X1 = con-ptr500:AK300/2: CONNECTOR; OC_FARNELL: unknown; OC_NEWARK: unknown
Y1 = 52101-101-REV-A_v16:CRYSTAL_NX5032GA: CRYSTAL; LCSC_PART: C115962

## Board
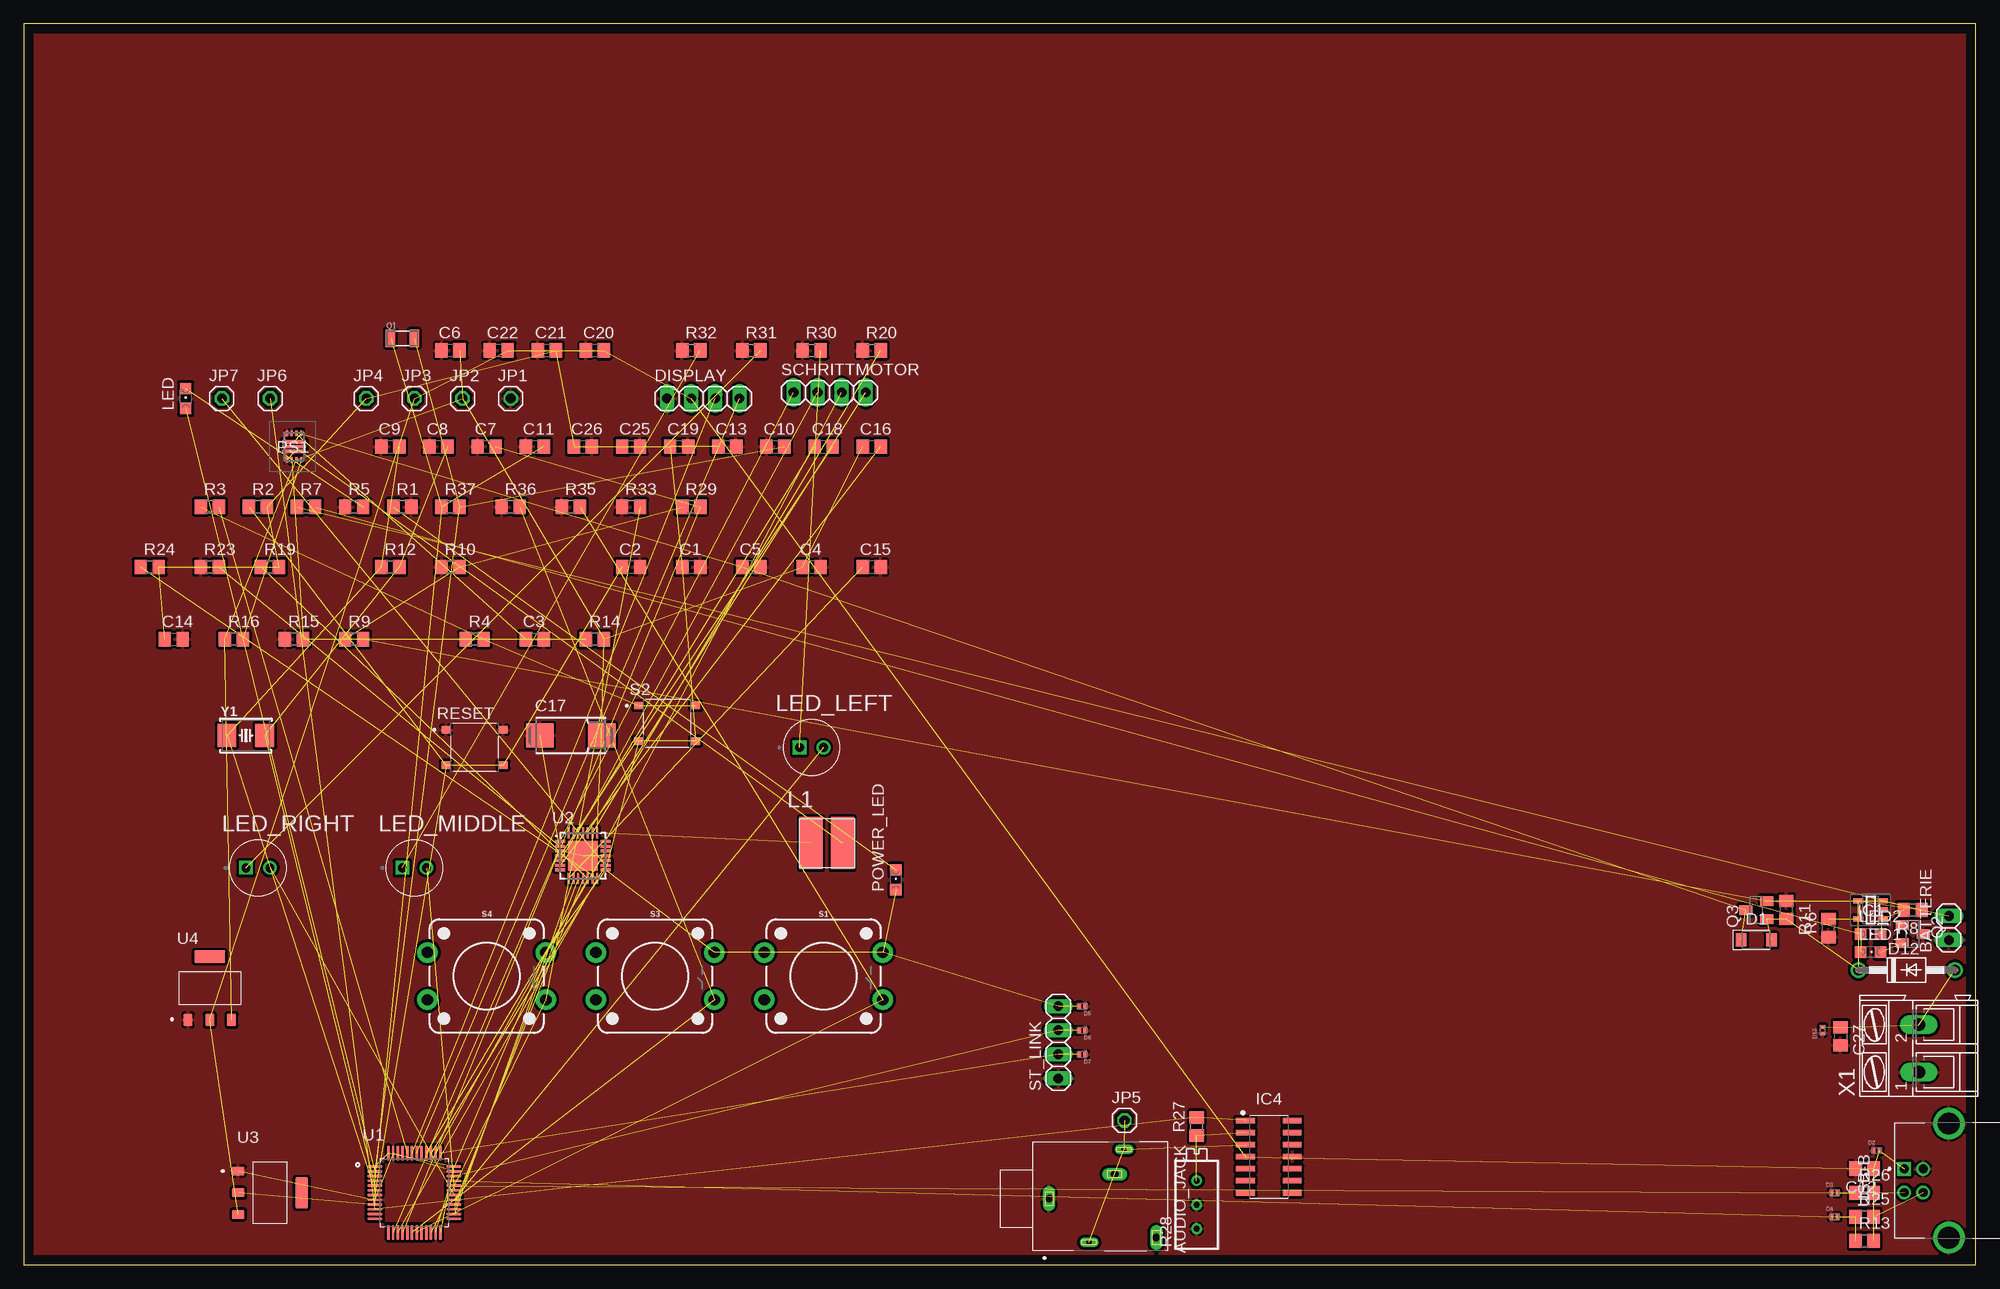
[diagram p4: board, top side]
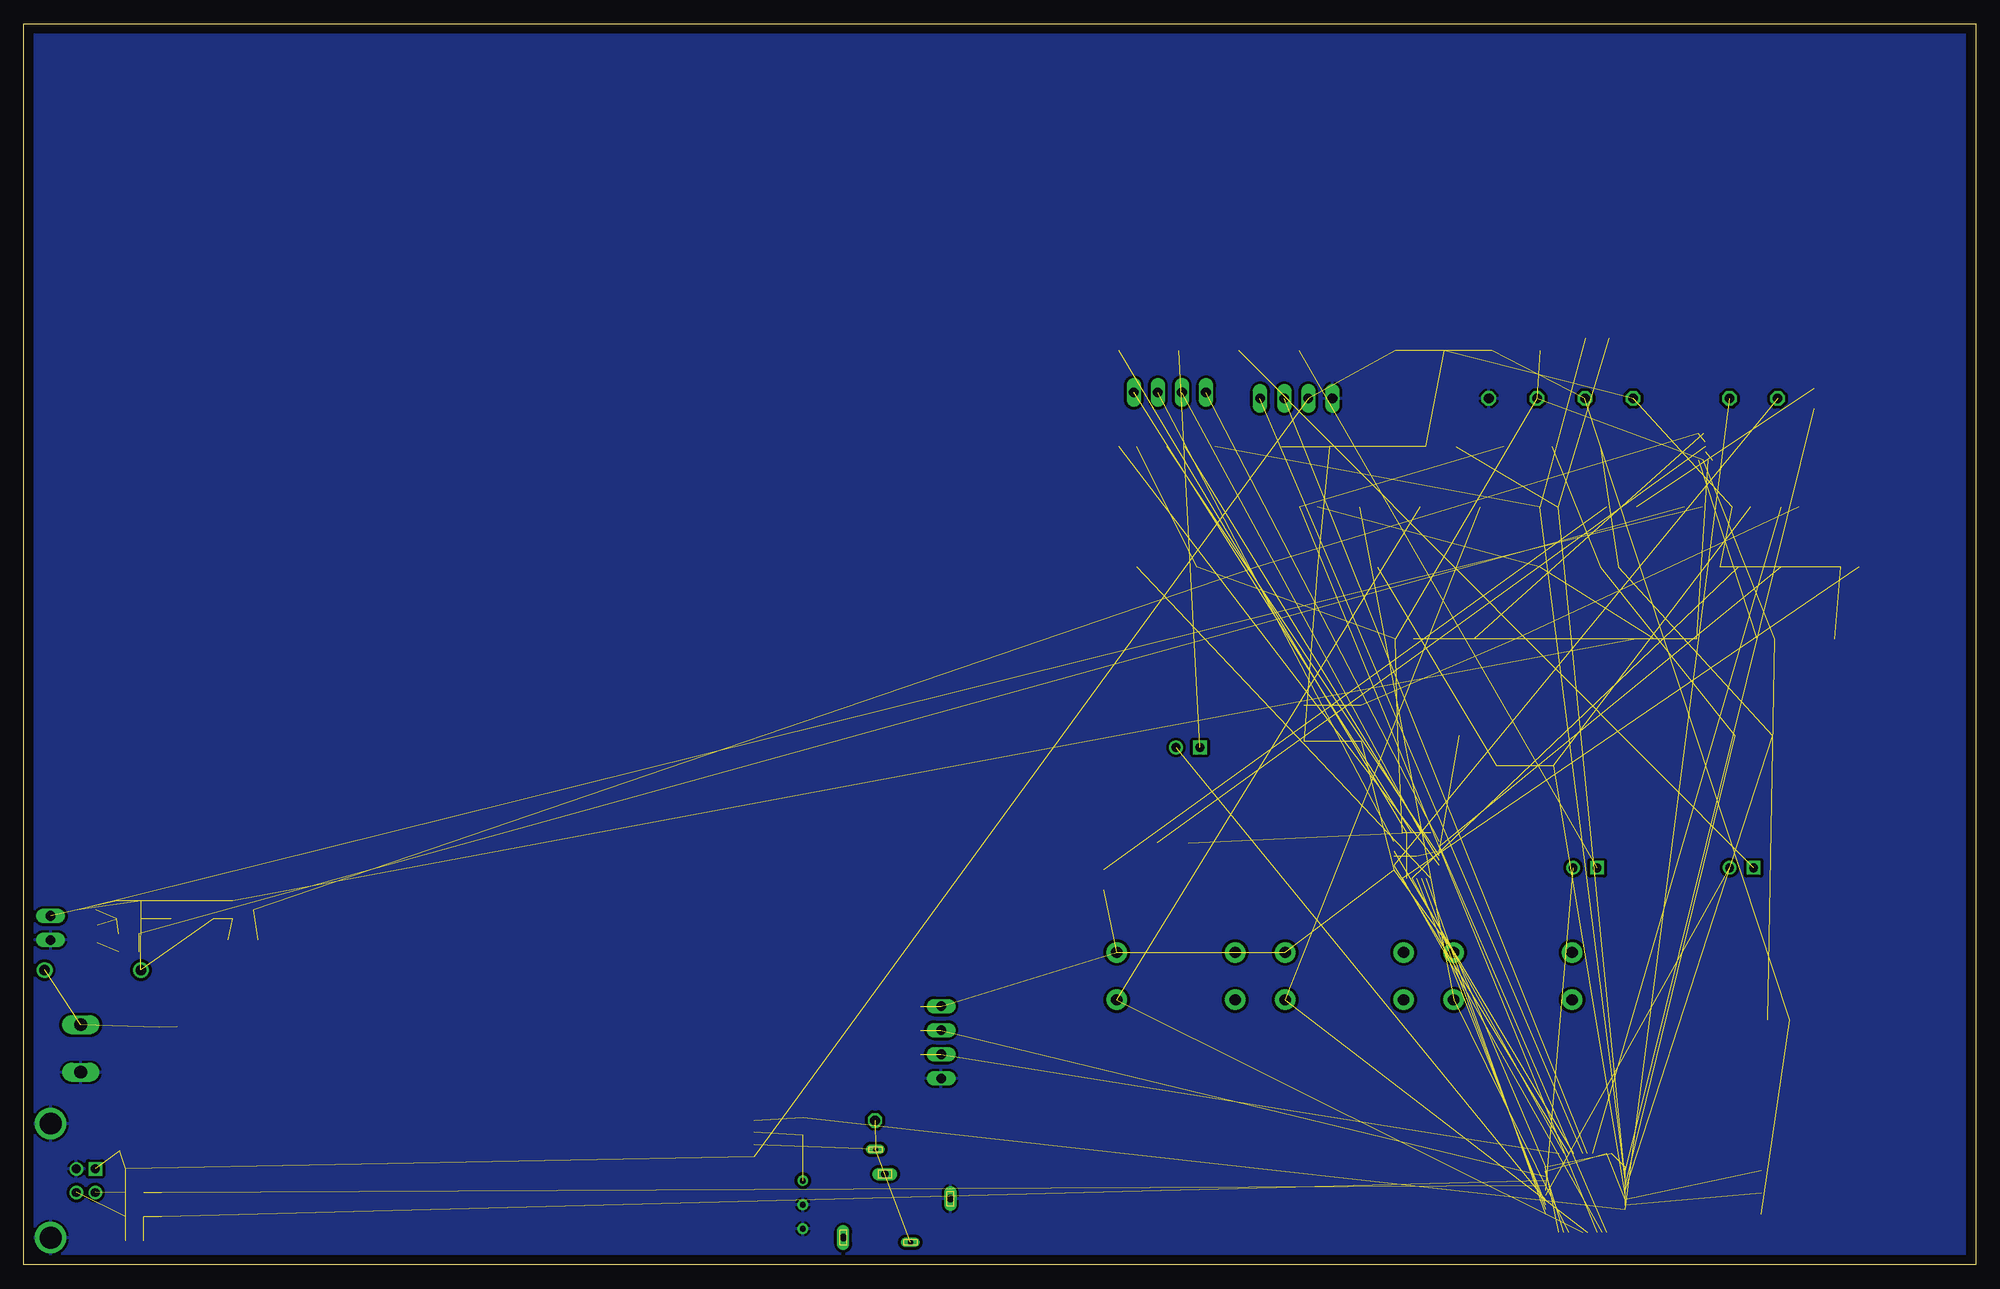
[diagram p5: board, bottom side, seen from below]

Size 206 x 131 mm. Coordinates in mm from the lower left corner, seen from the top.
Outline: 0,0 206,0 206,131 0,131 0,0
Copper layers (1*16): Top 0.035mm / dielectric 1.5mm / Bottom 0.035mm
Design rules "default *": minimum track width 6mil, minimum drill 0.35mm, track to track 12mil, track to pad 12mil, pad to pad 12mil, via to via 12mil, smd to smd 12mil, copper to edge 40mil, drill to drill 6mil, minimum pad ring 10mil, minimum via ring 8mil, stop-mask expansion 4mil, vias tented up to drill 0mil, thermal gap 10mil

### Footprints (pad centres in the part's own frame; a part is rotated, then mirrored left to right if it is on the bottom)
WENZHOU_PJ324M = drill 0.8 long: 1 0,5.4; 3 2.6,-1.5; 4 -4.1,-5.9 | drill 0.5 long: 2 5.2,-2.5; 5 -4.6,1.2
1X02 = drill 1.016 long: 1 -1.27,0; 2 1.27,0
C0805 = smd 1.3 x 1.5: 1 -0.95,0; 2 0.95,0
085CS_1AR = smd 2.9 x 2.5: + 3.25,0; - -3.25,0
SODFL3718X115 = smd 1.115 x 1.361: 1 -1.6,0; 2 1.6,0
DIO_TESD5V0L1UC_RJG = smd 0.41 x 0.56: 1 -0.35,0; 2 0.35,0
DO41-10 = drill 1.118: A 5.08,0; C -5.08,0
1X04 = drill 1.016 long: 1 -3.81,0; 2 -1.27,0; 3 1.27,0; 4 3.81,0
SOT95P280X100-5N = smd 1.05 x 0.55: 1 -1.3,0.95; 2 -1.3,0; 3 -1.3,-0.95; 4 1.3,-0.95; 5 1.3,0.95
SOIC127P600X175-14N = smd 1.968 x 0.599: 1 -2.473,3.81; 2 -2.473,2.54; 3 -2.473,1.27; 4 -2.473,0; 5 -2.473,-1.27; 6 -2.473,-2.54; 7 -2.473,-3.81; 8 2.473,-3.81; 9 2.473,-2.54; 10 2.473,-1.27; 11 2.473,0; 12 2.473,1.27; 13 2.473,2.54; 14 2.473,3.81
1X01 = drill 1.016 octagon: 1 0,0
PSPCAQ54 = smd 2.4 x 5.5: 1 1.215,2.615; 2 4.542,2.615
CHIPLED_0805 = smd 1.2 x 1.2: A 0,-1.05; C 0,1.05
LEDRD254W50D500H1060 = drill 0.93 pad 1.4: A 1.27,0 | drill 0.93 pad 1.4 square: C -1.27,0
TPS621361RGXT = smd 2.5 x 0.35: 1 0,0.5; 2 0,0; 3 0,-0.5 | smd 0.25 x 0.6: 4 -0.75,-1.4; 5 -0.25,-1.4; 6 0.25,-1.4; 7 0.75,-1.4; 8 0.75,1.4; 9 0.25,1.4; 10 -0.25,1.4; 11 -0.75,1.4
3.2X1.5 = smd 1 x 1.8: 1 -1.25,0; 2 1.25,0
SOT23 = smd 1 x 1.4: 1 -0.95,-1.1; 2 0.95,-1.1; 3 0,1.1
R0805 = smd 1.3 x 1.5: 1 -0.95,0; 2 0.95,0
RTRIM3296X = drill 0.61: 1 0,-2.54; 2 0,0; 3 0,2.54
SW_TS-1187A-B-A-B = smd 1 x 0.75: A -3,1.875; B 3,1.875; C -3,-1.875; D 3,-1.875
TACTILE_SWITCH_PTH_12MM = drill 1.2 pad 2.159: 1 6.25,-2.5; 2 -6.25,-2.5; 3 6.25,2.5; 4 -6.25,2.5
QFP50P900X900X160-48N = smd 1.56 x 0.28: 1 -4.18,2.75; 2 -4.18,2.25; 3 -4.18,1.75; 4 -4.18,1.25; 5 -4.18,0.75; 6 -4.18,0.25; 7 -4.18,-0.25; 8 -4.18,-0.75; 9 -4.18,-1.25; 10 -4.18,-1.75; 11 -4.18,-2.25; 12 -4.18,-2.75; 25 4.18,-2.75; 26 4.18,-2.25; 27 4.18,-1.75; 28 4.18,-1.25; 29 4.18,-0.75; 30 4.18,-0.25; 31 4.18,0.25; 32 4.18,0.75; 33 4.18,1.25; 34 4.18,1.75; 35 4.18,2.25; 36 4.18,2.75 | smd 0.28 x 1.56: 13 -2.75,-4.18; 14 -2.25,-4.18; 15 -1.75,-4.18; 16 -1.25,-4.18; 17 -0.75,-4.18; 18 -0.25,-4.18; 19 0.25,-4.18; 20 0.75,-4.18; 21 1.25,-4.18; 22 1.75,-4.18; 23 2.25,-4.18; 24 2.75,-4.18; 37 2.75,4.18; 38 2.25,4.18; 39 1.75,4.18; 40 1.25,4.18; 41 0.75,4.18; 42 0.25,4.18; 43 -0.25,4.18; 44 -0.75,4.18; 45 -1.25,4.18; 46 -1.75,4.18; 47 -2.25,4.18; 48 -2.75,4.18
QFN50P500X500X90-29N = smd 1.15 x 0.3: 1 -2.4,1.5; 2 -2.4,1; 3 -2.4,0.5; 4 -2.4,0; 5 -2.4,-0.5; 6 -2.4,-1; 7 -2.4,-1.5; 15 2.4,-1.5; 16 2.4,-1; 17 2.4,-0.5; 18 2.4,0; 19 2.4,0.5; 20 2.4,1; 21 2.4,1.5 | smd 0.3 x 1.15: 8 -1.5,-2.4; 9 -1,-2.4; 10 -0.5,-2.4; 11 0,-2.4; 12 0.5,-2.4; 13 1,-2.4; 14 1.5,-2.4; 22 1.5,2.4; 23 1,2.4; 24 0.5,2.4; 25 0,2.4; 26 -0.5,2.4; 27 -1,2.4; 28 -1.5,2.4 | smd 3.15 x 3.15: 29 0,0
SOT229P700X180-4N = smd 1.31 x 0.93: 1 -3.345,2.29; 2 -3.345,0; 3 -3.345,-2.29 | smd 1.31 x 3.24: 4 3.345,0
SOT229P700X180-4N' = smd 0.93 x 1.31: 1 -2.29,-3.345; 2 0,-3.345; 3 2.29,-3.345 | smd 3.24 x 1.31: 4 0,3.345
61729-1011BLF = drill 0.92 square: 1 1.25,4.71 | drill 0.92: 2 -1.25,4.71; 3 -1.25,2.71; 4 1.25,2.71 | drill 2.3: SH1 -6.02,0; SH2 6.02,0
AK300/2 = drill 1.321 long: 1 -2.515,0; 2 2.489,0
CRYSTAL_2-SMD-5X3 = smd 2 x 2.4: 1 -2,0; 2 2,0

### Placement (x,y rotation side)
AUDIO_JACK  113.62,6.99 90 top
BATTERIE  203.16,35.56 90 top
C1  70.44,73.66 0 top
C2  64.09,73.66 0 top
C3  53.93,66.04 0 top
C4  83.14,73.66 0 top
C5  76.79,73.66 0 top
C6  45.04,96.52 0 top
C7  48.85,86.36 0 top
C8  43.77,86.36 0 top
C9  38.69,86.36 0 top
C10  79.33,86.36 0 top
C11  53.93,86.36 0 top
C12  194.26,10.16 180 top
C13  74.25,86.36 0 top
C14  15.83,66.04 0 top
C15  89.49,73.66 0 top
C16  89.49,86.36 0 top
C17  57.74,55.88 0 top
C18  84.41,86.36 0 top
C19  69.17,86.36 0 top
C20  60.28,96.52 0 top
C21  55.2,96.52 0 top
C22  50.12,96.52 0 top
C25  64.09,86.36 0 top
C26  59.01,86.36 0 top
C27  191.72,24.13 270 top
D1  182.83,34.29 0 top
D2  195.53,12.06 0 top
D3  191.09,7.62 0 top
D4  191.09,5.08 0 top
D5  111.72,27.3 180 top
D6  111.72,24.77 180 top
D7  111.72,22.23 180 top
D12  198.71,31.11 0 top
D13  189.82,24.77 90 top
DISPLAY  71.71,91.44 0 top
IC1  194.9,37.47 180 top
IC4  131.4,11.43 0 top
JP1  51.39,91.44 0 top
JP2  46.31,91.44 0 top
JP3  41.23,91.44 0 top
JP4  36.15,91.44 0 top
JP5  116.16,15.24 0 top
JP6  25.99,91.44 0 top
JP7  20.91,91.44 0 top
L1  81.87,41.91 0 top
LED  17.1,91.44 0 top
LED1  194.9,33.02 270 top
LED2  194.9,34.92 270 top
LED_LEFT  83.14,54.61 0 top
LED_MIDDLE  41.23,41.91 0 top
LED_RIGHT  24.72,41.91 0 top
POWER_LED  92.03,40.64 0 top
PS1  28.53,86.36 0 top
Q1  39.96,97.79 0 top
Q2  199.34,34.92 270 top
Q3  182.83,37.47 90 top
R1  39.96,80.01 0 top
R2  24.72,80.01 0 top
R3  19.64,80.01 0 top
R4  47.58,66.04 0 top
R5  34.88,80.01 0 top
R6  190.45,35.56 90 top
R7  29.8,80.01 0 top
R8  199.34,37.47 180 top
R9  34.88,66.04 0 top
R10  45.04,73.66 0 top
R11  186.01,37.47 270 top
R12  38.69,73.66 0 top
R13  194.26,2.54 0 top
R14  60.28,66.04 0 top
R15  28.53,66.04 0 top
R16  22.18,66.04 0 top
R19  25.99,73.66 0 top
R20  89.49,96.52 0 top
R23  19.64,73.66 0 top
R24  13.29,73.66 0 top
R25  194.26,5.08 0 top
R26  194.26,7.62 0 top
R27  123.78,14.61 90 top
R28  123.78,6.35 0 top
R29  70.44,80.01 0 top
R30  83.14,96.52 0 top
R31  76.79,96.52 0 top
R32  70.44,96.52 0 top
R33  64.09,80.01 0 top
R35  57.74,80.01 0 top
R36  51.39,80.01 0 top
R37  45.04,80.01 0 top
RESET  47.58,54.61 0 top
S1  84.41,30.48 0 top
S2  67.9,57.15 0 top
S3  66.63,30.48 0 top
S4  48.85,30.48 0 top
SCHRITTMOTOR  85.05,92.08 0 top
ST_LINK  109.17,23.5 90 top
U1  41.23,7.62 0 top
U2  59.01,43.18 0 top
U3  25.99,7.62 0 top
U4  AMS1117-5.0  [SOT229P700X180-4N']  19.64,29.21 0 top
USB-B  203.16,8.89 90 top
X1  199.98,22.86 90 top
Y1  23.45,55.88 0 top

### Tracks (layer width: path | path; a pad name or v marks a point on that pad's centre or on a via)
+3V3  (25 unrouted)
+5V  (10 unrouted)
+12V  (11 unrouted)
A_BATTERY_LEVEL  (2 unrouted)
BOOT0  (1 unrouted)
BUTTON_1  (2 unrouted)
BUTTON_2  (2 unrouted)
BUTTON_3  (2 unrouted)
DISPLAY_SCL  (1 unrouted)
DISPLAY_SDA  (1 unrouted)
DRIVER_DIR  (1 unrouted)
DRIVER_ENABLE  (2 unrouted)
DRIVER_MS1  (1 unrouted)
DRIVER_MS2  (1 unrouted)
DRIVER_MS3  (1 unrouted)
DRIVER_RESET  (2 unrouted)
DRIVER_SLEEP  (2 unrouted)
DRIVER_STEP  (2 unrouted)
GND  (8 unrouted)
  pour Bottom (isolate 0.305): 0,0 206,0 206,131 0,131
  pour Top (isolate 0.305): 206,0 206,131 0,131 0,0
LED_LEFT  (1 unrouted)
LED_MIDDLE  (1 unrouted)
LED_RIGHT  (1 unrouted)
MOTOR1A  (1 unrouted)
MOTOR1B  (1 unrouted)
MOTOR2A  (1 unrouted)
MOTOR2B  (1 unrouted)
N$1  (1 unrouted)
N$2  (1 unrouted)
N$3  (1 unrouted)
N$4  (2 unrouted)
N$5  (3 unrouted)
N$6  (1 unrouted)
N$7  (2 unrouted)
N$8  (1 unrouted)
N$9  (3 unrouted)
N$10  (1 unrouted)
N$11  (2 unrouted)
N$12  (1 unrouted)
N$15  (3 unrouted)
N$16  (2 unrouted)
N$19  (1 unrouted)
N$20  (1 unrouted)
N$23  (1 unrouted)
N$26  (3 unrouted)
N$27  (1 unrouted)
N$29  (1 unrouted)
N$30  (1 unrouted)
N$62  (1 unrouted)
N$63  (1 unrouted)
N$64  (1 unrouted)
OSC32IN  (3 unrouted)
OSC32OUT  (3 unrouted)
OSCIN  (3 unrouted)
OSCOUT  (3 unrouted)
PC13  (1 unrouted)
RESET  (4 unrouted)
SIGNAL_IN  (3 unrouted)
SIGNAL_OPAMP  (3 unrouted)
SWDCLK  (2 unrouted)
SWDIO  (2 unrouted)
USB+  (3 unrouted)
USB-  (2 unrouted)
VBAT  (3 unrouted)
VIN  (4 unrouted)
VKLEMME  (6 unrouted)

### Text on the board
Framing: Power INPUTs